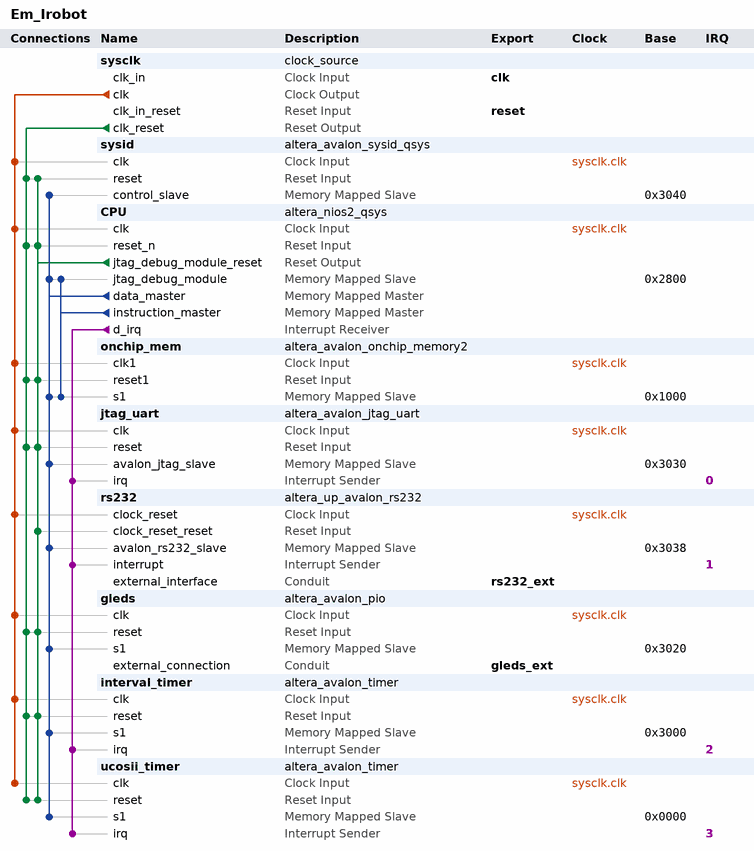
[diagram p0: system contents]
# Platform Designer (Qsys) system Em_Irobot
# Parameters at their usual value, and those the tool derives, are not listed.
package require -exact qsys 11.1
create_system Em_Irobot
set_project_property DEVICE_FAMILY CYCLONEIVE

add_instance sysclk clock_source 11.1
set_instance_parameter_value sysclk clockFrequency 50000000

add_instance sysid altera_avalon_sysid_qsys 11.1
set_instance_parameter_value sysid id 0

add_instance CPU altera_nios2_qsys 11.1
set_instance_parameter_value CPU resetSlave onchip_mem.s1
set_instance_parameter_value CPU exceptionSlave onchip_mem.s1
set_instance_parameter_value CPU breakSlave CPU.jtag_debug_module
set_instance_parameter_value CPU impl Fast
set_instance_parameter_value CPU icache_size 4096

add_instance onchip_mem altera_avalon_onchip_memory2 11.1
set_instance_parameter_value onchip_mem dataWidth 32
set_instance_parameter_value onchip_mem dualPort false
set_instance_parameter_value onchip_mem initMemContent true
set_instance_parameter_value onchip_mem initializationFileName onchip_mem
set_instance_parameter_value onchip_mem memorySize 4096

add_instance jtag_uart altera_avalon_jtag_uart 11.1
set_instance_parameter_value jtag_uart simInteractiveOptions INTERACTIVE_ASCII_OUTPUT

add_instance rs232 altera_up_avalon_rs232 11.1
set_instance_parameter_value rs232 baud 115200
set_instance_parameter_value rs232 parity None

add_instance gleds altera_avalon_pio 11.1
set_instance_parameter_value gleds direction Output
set_instance_parameter_value gleds width 8

add_instance interval_timer altera_avalon_timer 11.1
set_instance_parameter_value interval_timer period 1
set_instance_parameter_value interval_timer periodUnits MSEC
set_instance_parameter_value interval_timer timerPreset CUSTOM

add_instance ucosii_timer altera_avalon_timer 11.1
set_instance_parameter_value ucosii_timer period 10
set_instance_parameter_value ucosii_timer periodUnits MSEC
set_instance_parameter_value ucosii_timer timerPreset CUSTOM

# connections
add_connection sysclk.clk CPU.clk clock
add_connection sysclk.clk gleds.clk clock
add_connection sysclk.clk interval_timer.clk clock
add_connection sysclk.clk jtag_uart.clk clock
add_connection sysclk.clk onchip_mem.clk1 clock
add_connection sysclk.clk rs232.clock_reset clock
add_connection sysclk.clk sysid.clk clock
add_connection sysclk.clk ucosii_timer.clk clock
add_connection CPU.jtag_debug_module_reset CPU.reset_n reset
add_connection CPU.jtag_debug_module_reset gleds.reset reset
add_connection CPU.jtag_debug_module_reset interval_timer.reset reset
add_connection CPU.jtag_debug_module_reset jtag_uart.reset reset
add_connection CPU.jtag_debug_module_reset onchip_mem.reset1 reset
add_connection CPU.jtag_debug_module_reset rs232.clock_reset_reset reset
add_connection CPU.jtag_debug_module_reset sysid.reset reset
add_connection CPU.jtag_debug_module_reset ucosii_timer.reset reset
add_connection sysclk.clk_reset CPU.reset_n reset
add_connection sysclk.clk_reset gleds.reset reset
add_connection sysclk.clk_reset interval_timer.reset reset
add_connection sysclk.clk_reset jtag_uart.reset reset
add_connection sysclk.clk_reset onchip_mem.reset1 reset
add_connection sysclk.clk_reset sysid.reset reset
add_connection sysclk.clk_reset ucosii_timer.reset reset
add_connection CPU.data_master CPU.jtag_debug_module avalon
set_connection_parameter_value CPU.data_master/CPU.jtag_debug_module baseAddress 0x2800
add_connection CPU.data_master gleds.s1 avalon
set_connection_parameter_value CPU.data_master/gleds.s1 baseAddress 0x3020
add_connection CPU.data_master interval_timer.s1 avalon
set_connection_parameter_value CPU.data_master/interval_timer.s1 baseAddress 0x3000
add_connection CPU.data_master jtag_uart.avalon_jtag_slave avalon
set_connection_parameter_value CPU.data_master/jtag_uart.avalon_jtag_slave baseAddress 0x3030
add_connection CPU.data_master onchip_mem.s1 avalon
set_connection_parameter_value CPU.data_master/onchip_mem.s1 baseAddress 0x1000
add_connection CPU.data_master rs232.avalon_rs232_slave avalon
set_connection_parameter_value CPU.data_master/rs232.avalon_rs232_slave baseAddress 0x3038
add_connection CPU.data_master sysid.control_slave avalon
set_connection_parameter_value CPU.data_master/sysid.control_slave baseAddress 0x3040
add_connection CPU.data_master ucosii_timer.s1 avalon
set_connection_parameter_value CPU.data_master/ucosii_timer.s1 baseAddress 0x0000
add_connection CPU.instruction_master CPU.jtag_debug_module avalon
set_connection_parameter_value CPU.instruction_master/CPU.jtag_debug_module baseAddress 0x2800
add_connection CPU.instruction_master onchip_mem.s1 avalon
set_connection_parameter_value CPU.instruction_master/onchip_mem.s1 baseAddress 0x1000
add_connection CPU.d_irq interval_timer.irq interrupt
set_connection_parameter_value CPU.d_irq/interval_timer.irq irqNumber 2
add_connection CPU.d_irq jtag_uart.irq interrupt
set_connection_parameter_value CPU.d_irq/jtag_uart.irq irqNumber 0
add_connection CPU.d_irq rs232.interrupt interrupt
set_connection_parameter_value CPU.d_irq/rs232.interrupt irqNumber 1
add_connection CPU.d_irq ucosii_timer.irq interrupt
set_connection_parameter_value CPU.d_irq/ucosii_timer.irq irqNumber 3

# exported interfaces
add_interface clk clock sink
set_interface_property clk EXPORT_OF sysclk.clk_in
add_interface reset reset sink
set_interface_property reset EXPORT_OF sysclk.clk_in_reset
add_interface rs232_ext conduit end
set_interface_property rs232_ext EXPORT_OF rs232.external_interface
add_interface gleds_ext conduit end
set_interface_property gleds_ext EXPORT_OF gleds.external_connection

save_system Em_Irobot.qsys
